# Altium schematic sheet Y_line_07.SchDoc
size A2; SheetNumber: 3; SheetTotal: 9
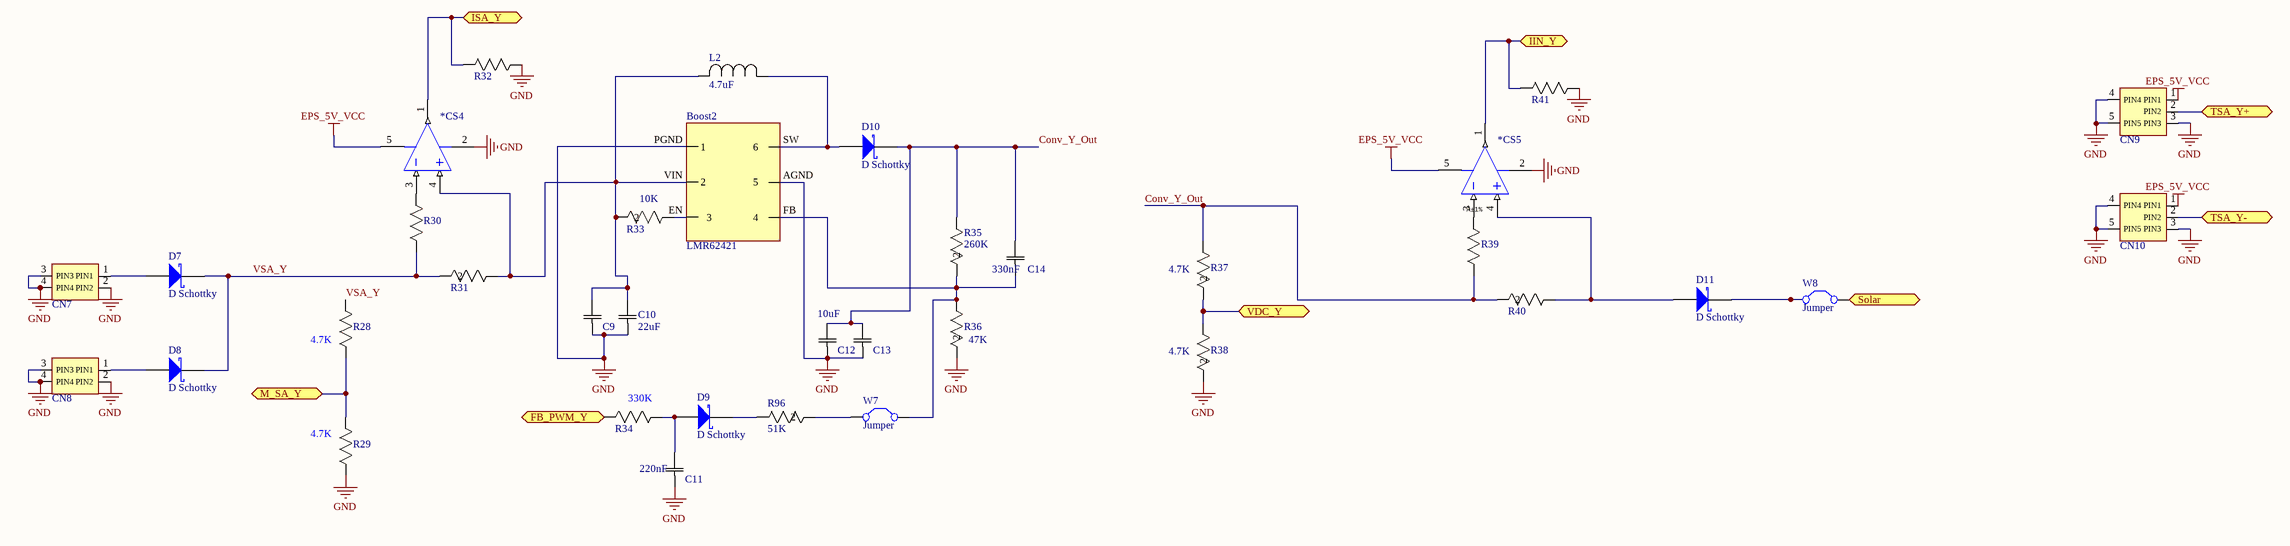
[diagram p0: Y_line_07.SchDoc]

## Parts
*CS4  CS4  [LT-S5-5-TSOT-23_N]  (value not drawn)
*CS5  CS5  [LT-S5-5-TSOT-23_N]  (value not drawn)
Boost2  LMR62421  [LMR62421]
C9  GRM155R71H103KA8  [RC0805N]  (value not drawn)
C10  22uF  [RC0805N]
C11  220nF  [RC0805N]
C12  10uF  [RC0805N]
C13  GRM155R71H103KA8  [RC0805N]  (value not drawn)
C14  330nF  [RC0805N]
CN7  SM02B-SRSS  [2pins]  (value not drawn)
CN8  SM02B-SRSS  [2pins]  (value not drawn)
CN9  SM03B-SRSS  [3pins]  (value not drawn)
CN10  SM03B-SRSS  [3pins]  (value not drawn)
D7  D Schottky  [SMB]
D8  D Schottky  [SMB]
D9  D Schottky  [SMB]
D10  D Schottky  [SMB]
D11  D Schottky  [SMB]
L2  4.7uF  [IND_SPM6530]
R28  Resistance_(Ohms): 4.7K  [RC0805N]  (hidden comment: RC0805FR)
R29  Resistance_(Ohms): 4.7K  [RC0805N]  (hidden comment: RC0805FR)
R30  RC0805FR  [RC0805N]  (value not drawn)
R31  RL0805FR-070R1L  [RC0805N]  (value not drawn)
R32  RC0805FR  [RC0805N]  (value not drawn)
R33  10K  [RC0805N]
R34  Resistance_(Ohms): 330K  [RC0805N]  (hidden comment: RC0805FR)
R35  260K  [RC0805N]
R36  47K  [RC0805N]
R37  4.7K  [RC0805N]
R38  4.7K  [RC0805N]
R39  Tolerance: Â±1%  [RC0805N]  (hidden comment: RC0805FR)
R40  RL0805FR-070R1L  [RC0805N]  (value not drawn)
R41  RC0805FR  [RC0805N]  (value not drawn)
R96  51K  [RC0805N]
W7  Jumper  [RAD-0.1]
W8  Jumper  [RAD-0.1]

## Ports
FB_PWM_Y, IIN_Y, ISA_Y, M_SA_Y, Solar, TSA_Y+, TSA_Y-, VDC_Y

## Nets
EPS_5V_VCC: *CS4.5(V+) *CS5.5(V+) CN9.1(PIN1) CN10.1(PIN1)
GND: *CS4.2(V-) *CS5.2(V-) Boost2.AGND(5) Boost2.PGND(1) C9.1 C10.1 C11.1 C12.1 C13.1 CN7.2(PIN2) CN7.3(PIN3) CN7.4(PIN4) CN8.2(PIN2) CN8.3(PIN3) CN8.4(PIN4) CN9.3(PIN3) CN9.4(PIN4) CN9.5(PIN5) CN10.3(PIN3) CN10.4(PIN4) CN10.5(PIN5) R29.2 R32.2 R36.2 R38.2 R41.2
Conv_Y_Out: C12.2 C13.2 C14.2 D10.2(K) R35.1 R37.1 R39.2 R40.2
FB_PWM_Y: R34.2 ; port FB_PWM_Y
IIN_Y: *CS5.1(OUT) R41.1 ; port IIN_Y
ISA_Y: *CS4.1(OUT) R32.1 ; port ISA_Y
M_SA_Y: R28.2 R29.1 ; port M_SA_Y
Solar: W8.2(C2) ; port Solar
TSA_Y+: CN9.2(PIN2) ; port TSA_Y+
TSA_Y-: CN10.2(PIN2) ; port TSA_Y-
VDC_Y: R37.2 R38.1 ; port VDC_Y
VSA_Y: D7.2(K) D8.2(K) R28.1 R30.2 R31.2
Net*CS4_3: *CS4.3(-IN) R30.1
Net*CS4_4: *CS4.4(+IN) Boost2.VIN(2) C9.2 C10.2 L2.2 R31.1 R33.2
Net*CS5_3: *CS5.3(-IN) R39.1
Net*CS5_4: *CS5.4(+IN) D11.1(A) R40.1
NetBoost2_EN: Boost2.EN(3) R33.1
NetBoost2_FB: Boost2.FB(4) C14.1 R35.2 R36.1 W7.2(C2)
NetBoost2_SW: Boost2.SW(6) D10.1(A) L2.1
NetC11_2: C11.2 D9.1(A) R34.1
NetCN7_1: CN7.1(PIN1) D7.1(A)
NetCN8_1: CN8.1(PIN1) D8.1(A)
NetD9_2: D9.2(K) R96.1
NetD11_2: D11.2(K) W8.1(C1)
NetR96_2: R96.2 W7.1(C1)

## Library data of the parts
*CS4 *CS5 = LT6106HS5#TRMPBF: Single Channel, Low Cost, High Side Current Sense Operational Amplifier, 0.2 MHz Typical GBW, 5-Pin SOT-23 (S5-5), High Temperature / Automotive, Pb-Free, Mini Reel; Linear Technology Part Number: LT6106; Manufacturer: Linear Technology; Channels (#): 1; GBW (MHz) Typical: 0.2; Is (mA) Typical: 0.06; Vos (mV) Guaranteed: 0.25; Vos (mV) Typical: 0.15; Vs Max (V): 36; Vs Min (V): 2.7; DatasheetVersion: Rev. A; PackageReference: LT-S5-5-TSOT-23; PackageDescription: 5-Lead Plastic TSOT-23, Body 1.63 x 2.90 mm, Pitch 0.95 mm; Supplier 1: Digi-Key; Supplier Part Number 1: LT6106HS5#TRMPBFTR-ND; Supplier 2: Digi-Key; Supplier Part Number 2: LT6106HS5#TRMPBFCT-ND; Supplier 3: Digi-Key; Supplier Part Number 3: LT6106HS5#TRMPBFDKR-ND; Supplier 4: Farnell; Supplier Part Number 4: 1663842; Supplier 5: Farnell; Supplier Part Number 5: 1663842RL; Supplier 6: Newark; Supplier Part Number 6: 57M9138; Packing: Mini Reel; RoHS: Pb-Free; Type: CSA; Mounting Technology: Surface Mount; Code_JEDEC: MO-193; PartNumber: LT6106HS5#TRMPBF; ComponentLink1Description: Manufacturer URL; ComponentLink1URL: http://www.linear.com/; ComponentLink2Description: Datasheet; ComponentLink2URL: http://cds.linear.com/docs/en/datasheet/6106fa.pdf; ComponentLink3Description: Package Specification; ComponentLink3URL: http://cds.linear.com/docs/en/packaging/SOT_5_05-08-1635.pdf
Boost2 = Component_1: LMR62421XSDDEMO: 12V @ 500mA, 2.7 ~ 5.5V in
C9 C13 = GRM155R71H103KA8: Ceramic Capacitor 0402; Manufacturer_Part_Number: GRM155R71H103KA88D; Vendor: Murata; C: Copyright (C) 2015 Accelerated Designs. All rights reserved; Copyright: Copyright (C) 2015 Accelerated Designs. All rights reserved; Value: Value; Package/Case: 0402(1005metric)
C10 C14 = GRM155R71H103KA8: Ceramic Capacitor; Manufacturer_Part_Number: GRM155R71H103KA88D; Vendor: Murata; C: Copyright (C) 2015 Accelerated Designs. All rights reserved; Copyright: Copyright (C) 2015 Accelerated Designs. All rights reserved; Value: Value; Package/Case: 0402(1005metric)
C11 C12 = GRM188R71H472KA0: Ceramic Capacitor 47uF 0603; Manufacturer_Part_Number: GRM188R71H472KA01D; Vendor: Murata; C: Copyright (C) 2015 Accelerated Designs. All rights reserved; Copyright: Copyright (C) 2015 Accelerated Designs. All rights reserved; Package/Case: 0603 (1608 Metric)
  C11: Value: 220nF
  C12: Value: Value
CN7 CN8 = 2Pin_Connector: CONN HEADER SH 2POS SIDE 1MM TIN; Manufacturer Part Number: SM02B-SRSS-TB(LF)(SN); Manufacturer: JST Sales America Inc.; Digi-Key Part Number: 455-1802-1-ND; Contact Type: Male Pin
CN9 CN10 = 3PIN_Connector: CONN HEADER SH 3POS SIDE 1MM TIN; Manufacturer Part Number: SM03B-SRSS-TB(LF)(SN); Manufacturer: JST Sales America Inc.; Digi-Key Part Number: 455-1803-1-ND; Contact Type: Male Pin; Mounting Type: Surface Mount, Right Angle
D7-D11 = D Schottky: Schottky Diode, 1A; Published: 8-Jun-2000; LatestRevisionDate: 17-Jul-2002; LatestRevisionNote: Re-released for DXP Platform.; PackageReference: SMB; Publisher: Altium Limited; PackageDescription: DO-214-AA/SMB; 2 C-Bend Leads; Body 5.3 x 3.6 mm, inc. leads (LxW); Code_JEDEC: DO-214-AA
L2 = SPM6530T-4R7M: Inductor, 4.7uH; Vendor: TDK; C: Copyright (C) 2015 Accelerated Designs. All rights reserved; Manufacturer_Part_Number: SPM6530T-4R7M; Copyright: Copyright (C) 2015 Accelerated Designs. All rights reserved; Value: Value
R28 R29 R37 R38 = RC0805FR: Thick Film Resistors 0805; Manufacturer_Part_Number: RC0805FR-074K7L; Vendor: Yageo; Resistance_In_Ohms: 4.70K; Power_(Watts): 0.125W, 1/8W; Tolerance: Â±1%; Lead_Style: Surface Mount (SMD - SMT); Voltage_-_Working: 150V; Temperature_Coefficient: Â±100ppm/Â°C; Number_of_Terminations: 2; C: Copyright (C) 2015 Accelerated Designs. All rights reserved; DigiKeyPartNumber: 311-4.70KCRTR-ND; Quantity_Available: 0; Copyright: Copyright (C) 2015 Accelerated Designs. All rights reserved; DataSheet: http://www.yageo.com/documents/recent/PYu-RC0805_51_RoHS_L_4.pdf; Case: 0805 (2012 metric); Packaging: Tape &amp; Reel (TR); Composition: Thick Film; NewarkPartNumber: 10R0398; Features: -; Package_/_Case: 0805 (2012 Metric); Size_/_Dimension: 0.079" L x 0.049" W (2.00mm x 1.25mm); Height: 0.024" (0.60mm); Value: Value
  R37 R38: Resistance_(Ohms): 4.7K
R30 R32 R33 R35 R36 R41 R96 = RC0805FR: Thick Film Resistors 0805; Manufacturer_Part_Number: RC0805FR-074K7L; Vendor: Yageo; Resistance_In_Ohms: 4.70K; Power_(Watts): 0.125W, 1/8W; Tolerance: Â±1%; Lead_Style: Surface Mount (SMD - SMT); Voltage_-_Working: 150V; Temperature_Coefficient: Â±100ppm/Â°C; Resistance_(Ohms): 4.7K; Number_of_Terminations: 2; C: Copyright (C) 2015 Accelerated Designs. All rights reserved; DigiKeyPartNumber: 311-4.70KCRTR-ND; Quantity_Available: 0; Copyright: Copyright (C) 2015 Accelerated Designs. All rights reserved; DataSheet: http://www.yageo.com/documents/recent/PYu-RC0805_51_RoHS_L_4.pdf; Case: 0805 (2012 metric); Packaging: Tape &amp; Reel (TR); Composition: Thick Film; NewarkPartNumber: 10R0398; Features: -; Package_/_Case: 0805 (2012 Metric); Size_/_Dimension: 0.079" L x 0.049" W (2.00mm x 1.25mm); Height: 0.024" (0.60mm); Value: Value
R31 R40 = RL0805FR-070R1L: Sense Resistor 100m ohm 0805; Vendor: Yageo; Resistance_In_Ohms: 0.10; Power_(Watts): 0.125W, 1/8W; Tolerance: Â±1%; Lead_Style: Surface Mount (SMD - SMT); Voltage_-_Working: 300V; Temperature_Coefficient: Â±600ppm/Â°C; Resistance_(Ohms): 0.1; Number_of_Terminations: 2; C: Copyright (C) 2015 Accelerated Designs. All rights reserved; DigiKeyPartNumber: 311-.10STR-ND; Manufacturer_Part_Number: RL0805FR-070R1L; Quantity_Available: 25000; Copyright: Copyright (C) 2015 Accelerated Designs. All rights reserved; DataSheet: http://www.yageo.com/documents/recent/PYu-RL_521_RoHS_L_5.pdf; Case: 0805 (2012 metric); Packaging: Tape &amp; Reel (TR); Composition: Thick Film; NewarkPartNumber: 66R6321; Features: Current Sense; Package_/_Case: 0805 (2012 Metric); Size_/_Dimension: 0.079" L x 0.049" W (2.00mm x 1.25mm); Height: 0.024" (0.60mm); Value: Value
R34 = RC0805FR: Thick Film Resistors 0805; Manufacturer_Part_Number: RC0805FR-074K7L; Vendor: Yageo; Power_(Watts): 0.125W, 1/8W; Tolerance: Â±1%; Lead_Style: Surface Mount (SMD - SMT); Voltage_-_Working: 150V; Temperature_Coefficient: Â±100ppm/Â°C; Number_of_Terminations: 2; C: Copyright (C) 2015 Accelerated Designs. All rights reserved; DigiKeyPartNumber: 311-4.70KCRTR-ND; Quantity_Available: 0; Copyright: Copyright (C) 2015 Accelerated Designs. All rights reserved; DataSheet: http://www.yageo.com/documents/recent/PYu-RC0805_51_RoHS_L_4.pdf; Resistance_In_Ohms: 330K; Case: 0805 (2012 metric); Packaging: Tape &amp; Reel (TR); Composition: Thick Film; NewarkPartNumber: 10R0398; Features: -; Package_/_Case: 0805 (2012 Metric); Size_/_Dimension: 0.079" L x 0.049" W (2.00mm x 1.25mm); Height: 0.024" (0.60mm); Value: Value
R39 = RC0805FR: Thick Film Resistors 0805; Manufacturer_Part_Number: RC0805FR-074K7L; Vendor: Yageo; Resistance_In_Ohms: 4.70K; Power_(Watts): 0.125W, 1/8W; Lead_Style: Surface Mount (SMD - SMT); Voltage_-_Working: 150V; Temperature_Coefficient: Â±100ppm/Â°C; Resistance_(Ohms): 4.7K; Number_of_Terminations: 2; C: Copyright (C) 2015 Accelerated Designs. All rights reserved; DigiKeyPartNumber: 311-4.70KCRTR-ND; Quantity_Available: 0; Copyright: Copyright (C) 2015 Accelerated Designs. All rights reserved; DataSheet: http://www.yageo.com/documents/recent/PYu-RC0805_51_RoHS_L_4.pdf; Case: 0805 (2012 metric); Packaging: Tape &amp; Reel (TR); Composition: Thick Film; NewarkPartNumber: 10R0398; Features: -; Package_/_Case: 0805 (2012 Metric); Size_/_Dimension: 0.079" L x 0.049" W (2.00mm x 1.25mm); Height: 0.024" (0.60mm); Value: Value
W7 W8 = Jumper: Jumper Wire; Published: 24-Mar-1999; LatestRevisionDate: 17-Jul-2002; LatestRevisionNote: Re-released for DXP Platform.; PackageReference: RAD-0.2; Publisher: Altium Limited; PackageDescription: Radial Cap, Thru-Hole; 2 Leads; 0.2 in Pin Spacing